# Altium schematic sheet power-v3v3.SchDoc: Copper Suicide - Power 3.3V
size Letter; CheckedBy: J. Brinton; CompanyName: Signal Laboratories, Inc.; DrawnBy: J. Brinton; Engineer: J. Brinton; Address1: 3479 Edison Way; Address2: Menlo Park CA 94025; Address3: +1 (877) 778-8435; Address4: siglabs.com; Revision: 3; SheetNumber: 41; SheetTotal: 47
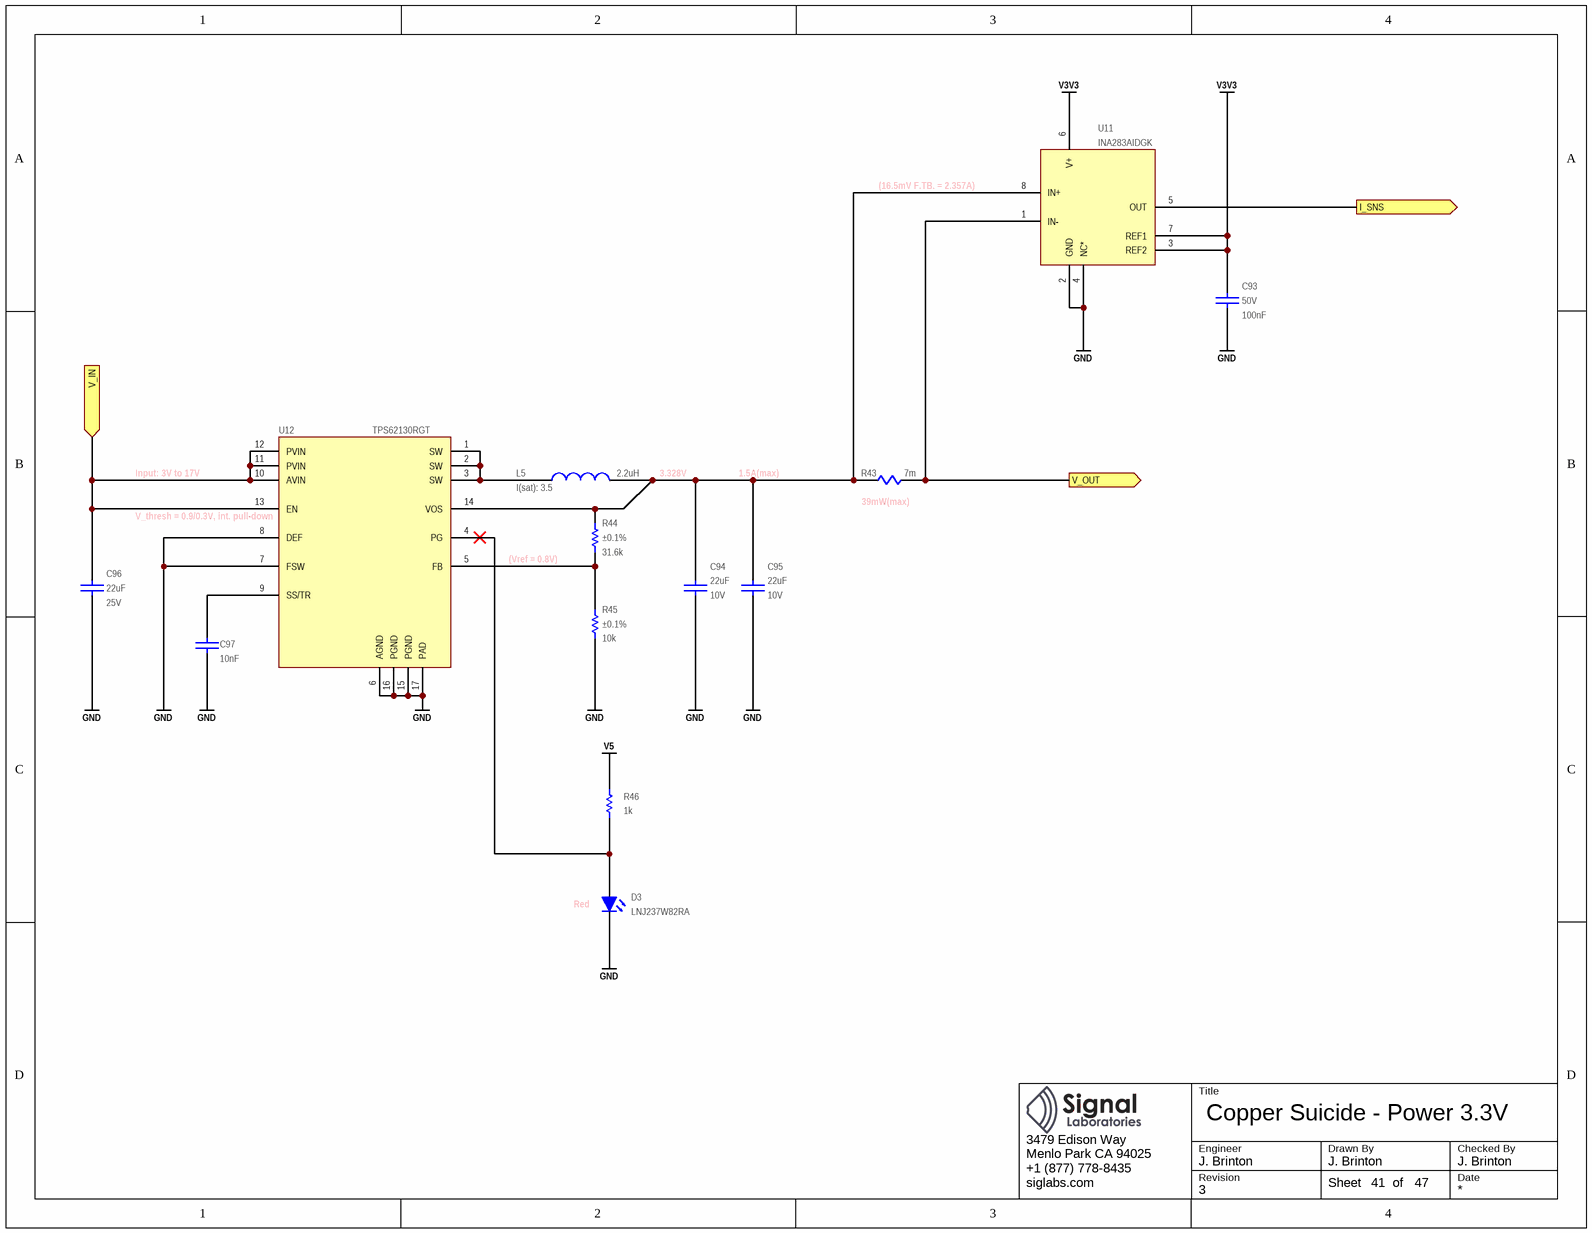
[diagram p0: power-v3v3.SchDoc]

## Parts
C93  value 100nF  Voltage: 50V  [CAPC100X50X55L25N]  (hidden comment: GCM155R71H104KE02)
C94  value 22uF  Voltage: 10V  [CAPC200X125X145L45N]  (hidden comment: C2012X7S1A226M125)
C95  value 22uF  Voltage: 10V  [CAPC200X125X145L45N]  (hidden comment: C2012X7S1A226M125)
C96  value 22uF  Voltage: 25V  [CAPC320X250X270L50N]  (hidden comment: GRM32ER71E226KE15)
C97  value 10nF  [CAPC100X50X55L25N]  (hidden comment: GRM155R71H103KA88)
D3  LNJ237W82RA  [0603_LED]
L5  value 2.2uH  I(sat): 3.5  [XFL4020]  (hidden comment: XFL4020-222ME)
R43  value 7m  [RESC3216X80L110N]  (hidden comment: CSR1206-0R007F1)
R44  value 31.6k  Tolerance: ±0.1%  [RESC2012X70N]  (hidden comment: ERA-6AEB3162V)
R45  value 10k  Tolerance: ±0.1%  [RESC2012X70N]  (hidden comment: ERA-6AEB103V)
R46  value 1k  [RESC1005X40N]  (hidden comment: ERJ-2RKF1001X)
U11  INA283AIDGK  [S-PDSO-G8]
U12  TPS62130RGT  [S-PQFP-8N]

## Ports
I_SNS (out), V_IN (in), V_OUT (out)

## Nets
GND: C93.1 C94.1 C95.1 C96.1 C97.2 D3.2(K) R45.1 U11.2(GND) U11.4(NC*) U12.6(AGND) U12.7(FSW) U12.8(DEF) U12.15(PGND) U12.16(PGND) U12.17(PAD)
V3V3: C93.2 U11.3(REF2) U11.6(V+) U11.7(REF1)
V5: R46.2
I_SNS: U11.5(OUT) ; port I_SNS
V_IN: C96.2 U12.10(AVIN) U12.11(PVIN) U12.12(PVIN) U12.13(EN) ; port V_IN
V_OUT: R43.2 U11.1(IN-) ; port V_OUT
NetC94_2: C94.2 C95.2 L5.2 R43.1 R44.2 U11.8(IN+) U12.14(VOS)
NetC97_1: C97.1 U12.9(SS/TR)
NetD3_1: D3.1(A) R46.1 U12.4(PG)
NetL5_1: L5.1 U12.1(SW) U12.2(SW) U12.3(SW)
NetR44_1: R44.1 R45.2 U12.5(FB)

## Notes on the sheet
- (16.5mV F.TB. = 2.357A)
- Input: 3V to 17V
- (near U12) V_thresh = 0.9/0.3V, int. pull-down
- 3.328V
- 1.5A(max)
- (near R43) 39mW(max)
- (near R44) (Vref = 0.8V)
- (near D3) Red
- Title
- Engineer
- Revision
- Drawn By
- Checked By
- Date
- Sheet
- of

## Library data of the parts
C93 = CAP: Ceramic Capacitor 100nF ±10% 50V X7R 0402; Manufacturer: Murata; Tr: -55:125; Manufacturer P/N: GCM155R71H104KE02; Tolerance: ±10%; Package: 0402
C94 C95 = CAP: Ceramic Capacitor 22uF ±20% 10V X7S 0805; Manufacturer: TDK; Tr: -55:125; Manufacturer P/N: C2012X7S1A226M125; Tolerance: ±20%; Package: 0805
C96 = CAP: Ceramic Capacitor 22uF ±10% 25V X7R 1210; Manufacturer: Murata; Tr: -55:125; Manufacturer P/N: GRM32ER71E226KE15; Tolerance: ±10%; Package: 1210
C97 = CAP: Ceramic Capacitor 10nF ±10% 50V X7R 0402; Manufacturer: Murata; Tr: -55:125; Manufacturer P/N: GRM155R71H103KA88; Tolerance: ±10%; Voltage: 50V; Package: 0402
D3 = LED0603RD: LED, SMT 0603, Color Red, 5mA, 1.85V; Manufacturer: Panasonic; Manufacturer P/N: LNJ237W82RA; Package: 0603 Polarized
L5 = COIL: Wirewound Inductor 2.2uH +/-20% 3.5A SMD; Manufacturer: Coilcraft; Manufacturer P/N: XFL4020-222ME
R43 = CSR1206-0R001F1: Current Sense Resistor 7mOhm +/-1% SMD 1206; Manufacturer: Riedon; Manufacturer P/N: CSR1206-0R007F1; Package: 1206
R44 = RES: Thin Film Resistor 31.6k ±0.1% 0.125W 100V 0805; Manufacturer: Panasonic; Tcr: ±25; Tr: -55:155; Voltage: 100; Power: 0.125; Manufacturer P/N: ERA-6AEB3162V; Package: 0805
R45 = RES: Thin Film Resistor 10k ±0.1% 0.125W 100V 0805; Manufacturer: Panasonic; Tcr: ±25; Tr: -55:155; Voltage: 100; Power: 0.125; Manufacturer P/N: ERA-6AEB103V; Package: 0805
R46 = RES: Thick Film Resistor 1k ±1% 0.1W 50V 0402; Manufacturer: Panasonic; Tcr: ±100; Tr: -55:155; Voltage: 50; Power: 0.1; Manufacturer P/N: ERJ-2RKF1001X; Tolerance: ±1%; Alternatives: *; Footprint: *; Package: 0402
U11 = INA283AIDGK: Bidirectional Current Shunt Monitor; Manufacturer: Texas Instruments; Manufacturer P/N: INA283AIDGK
U12 = TPS62130RGT: 3-17V 3A Step-Down Converter VQFN; Manufacturer: Texas Instruments; Manufacturer P/N: TPS62130RGT